# Altium project LPF-SWR.PrjPcb
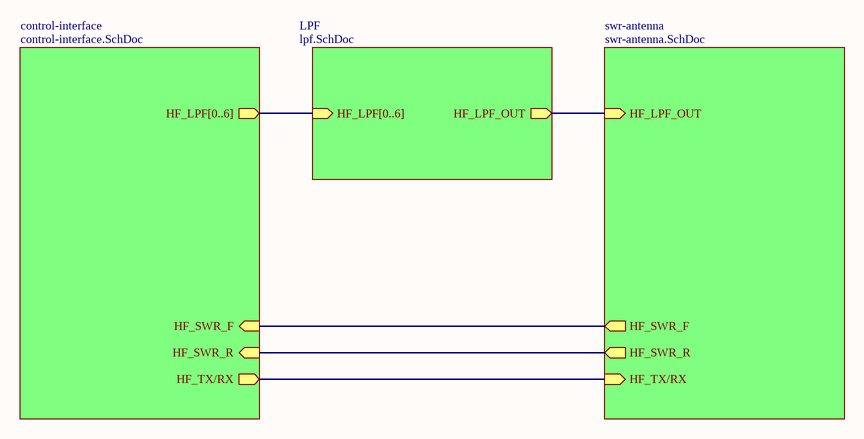
[diagram p0: lpf-swr-srtucture.SchDoc]
4 sheets, 107 parts. Net scope: hierarchical (ports join the sheet entries above them; power ports are global).
Board file: LPF-SWR.PcbDoc
Sheets:
  lpf-swr-srtucture.SchDoc
    control-interface = control-interface.SchDoc
    LPF = lpf.SchDoc
    swr-antenna = swr-antenna.SchDoc

## Sheet lpf-swr-srtucture.SchDoc
size A4; SheetNumber: 1; SheetTotal: 4

### Sub-sheets
control-interface = control-interface.SchDoc: HF_LPF[0..6] (out), HF_SWR_F (in), HF_SWR_R (in), HF_TX/RX (out)
LPF = lpf.SchDoc: HF_LPF_OUT (out), HF_LPF[0..6] (in)
swr-antenna = swr-antenna.SchDoc: HF_LPF_OUT (in), HF_SWR_F (out), HF_SWR_R (out), HF_TX/RX (in)

### Nets
HF_LPF_OUT: sheet LPF/HF_LPF_OUT, sheet swr-antenna/HF_LPF_OUT
HF_TX/RX: sheet control-interface/HF_TX/RX, sheet swr-antenna/HF_TX/RX
NetCON1_12: sheet control-interface/HF_SWR_R, sheet swr-antenna/HF_SWR_R
NetCON1_14: sheet control-interface/HF_SWR_F, sheet swr-antenna/HF_SWR_F

### Buses and harness runs
bus sheet control-interface/HF_LPF[0..6] = sheet LPF/HF_LPF[0..6]

## Sheet control-interface.SchDoc
size A4; SheetNumber: 2; SheetTotal: 4
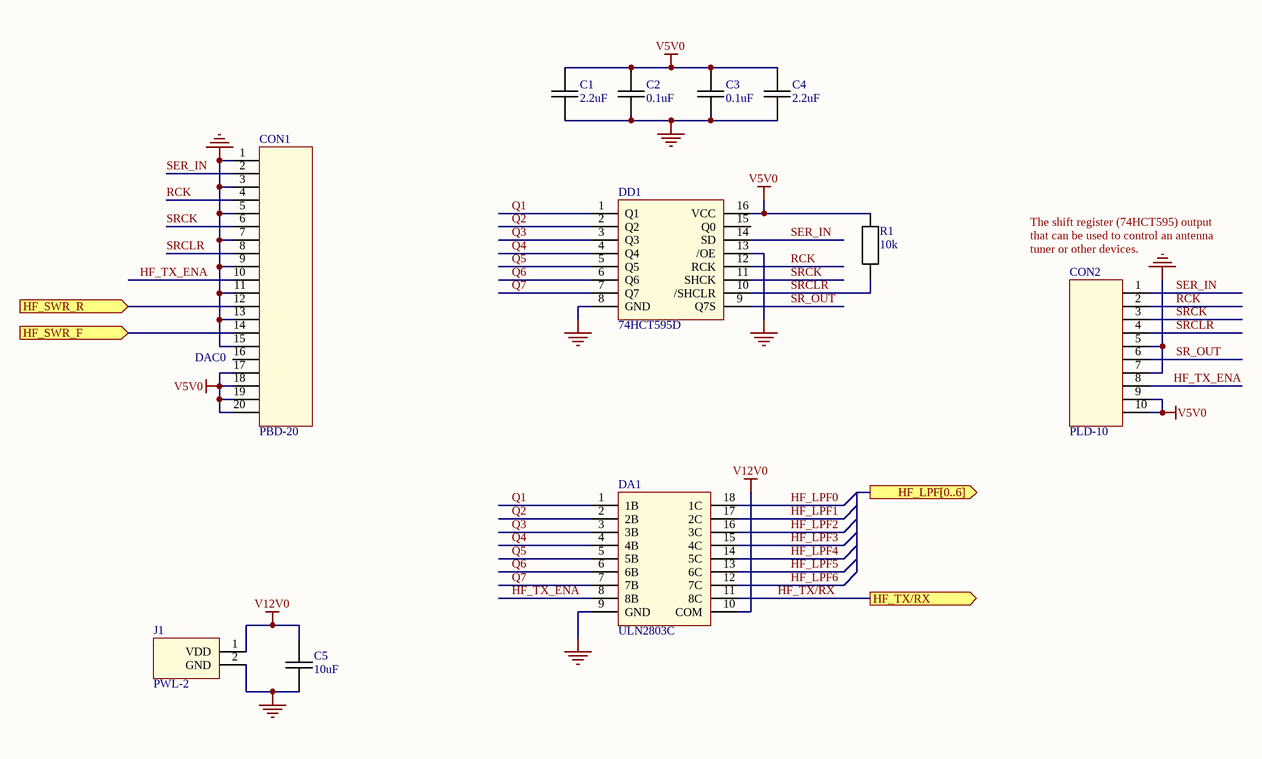
[diagram p1: control-interface.SchDoc]

### Parts
C1  2.2uF  [CAPC2013X100N]
C2  0.1uF  [CAPC2013X100N]
C3  0.1uF  [CAPC2013X100N]
C4  2.2uF  [CAPC2013X100N]
C5  10uF  [CAPC2013X100N]
CON1  PBD-20  [PBD-20]
CON2  PLD-10  [PLD-10R]
DA1  ULN2803C  [SOIC127P1030X265-18N]
DD1  74HCT595D  [SOIC127P600X175-16N]
J1  PWL-2  [PWL-2R]
R1  10k  [RESC2013X64N]

### Ports
HF_LPF[0..6] (out), HF_SWR_F (in), HF_SWR_R (in), HF_TX/RX (out)

### Nets
GND: C1.1 C2.1 C3.1 C4.1 C5.2 CON1.1 CON1.3 CON1.5 CON1.7 CON1.9 CON1.11 CON1.13 CON1.15 CON2.5 CON2.7 DA1.9(GND) DD1.8(GND) DD1.13(/OE) J1.2(GND)
V5V0: C1.2 C2.2 C3.2 C4.2 CON1.17 CON1.18 CON1.19 CON1.20 CON2.9 CON2.10 DD1.16(VCC) R1.2
V12V0: C5.1 DA1.10(COM) J1.1(VDD)
HF_LPF0: DA1.18(1C)
HF_LPF1: DA1.17(2C)
HF_LPF2: DA1.16(3C)
HF_LPF3: DA1.15(4C)
HF_LPF4: DA1.14(5C)
HF_LPF5: DA1.13(6C)
HF_LPF6: DA1.12(7C)
HF_TX/RX: DA1.11(8C) ; port HF_TX/RX
HF_TX_ENA: CON1.10 CON2.8 DA1.8(8B)
Q1: DA1.1(1B) DD1.1(Q1)
Q2: DA1.2(2B) DD1.2(Q2)
Q3: DA1.3(3B) DD1.3(Q3)
Q4: DA1.4(4B) DD1.4(Q4)
Q5: DA1.5(5B) DD1.5(Q5)
Q6: DA1.6(6B) DD1.6(Q6)
Q7: DA1.7(7B) DD1.7(Q7)
RCK: CON1.4 CON2.2 DD1.12(RCK)
SER_IN: CON1.2 CON2.1 DD1.14(SD)
SR_OUT: CON2.6 DD1.9(Q7S)
SRCK: CON1.6 CON2.3 DD1.11(SHCK)
SRCLR: CON1.8 CON2.4 DD1.10(/SHCLR) R1.1
NetCON1_12: CON1.12 ; port HF_SWR_R
NetCON1_14: CON1.14 ; port HF_SWR_F

Not connected (* = marked no-connect by the designer): CON1 16; DD1 15(Q0)

### Notes on the sheet
- (near CON2) The shift register (74HCT595) output that can be used to control an antenna tuner or other devices.
- (near CON1) DAC0

### Library data of the parts
C1-C5 = Cap0805: Capacitor 2x1.25 mm
CON1 = CONNECTOR-20
CON2 = CONNECTOR-10
DA1 = ULN2803A: Darlington Transistor Array
DD1 = 74HCT595D: 8-bit serial-in, serial or parallel-out shift register with output / latches; 3-state
J1 = PWR_CONNECTOR
R1 = Res0805

## Sheet lpf.SchDoc
size A4; SheetNumber: 3; SheetTotal: 4
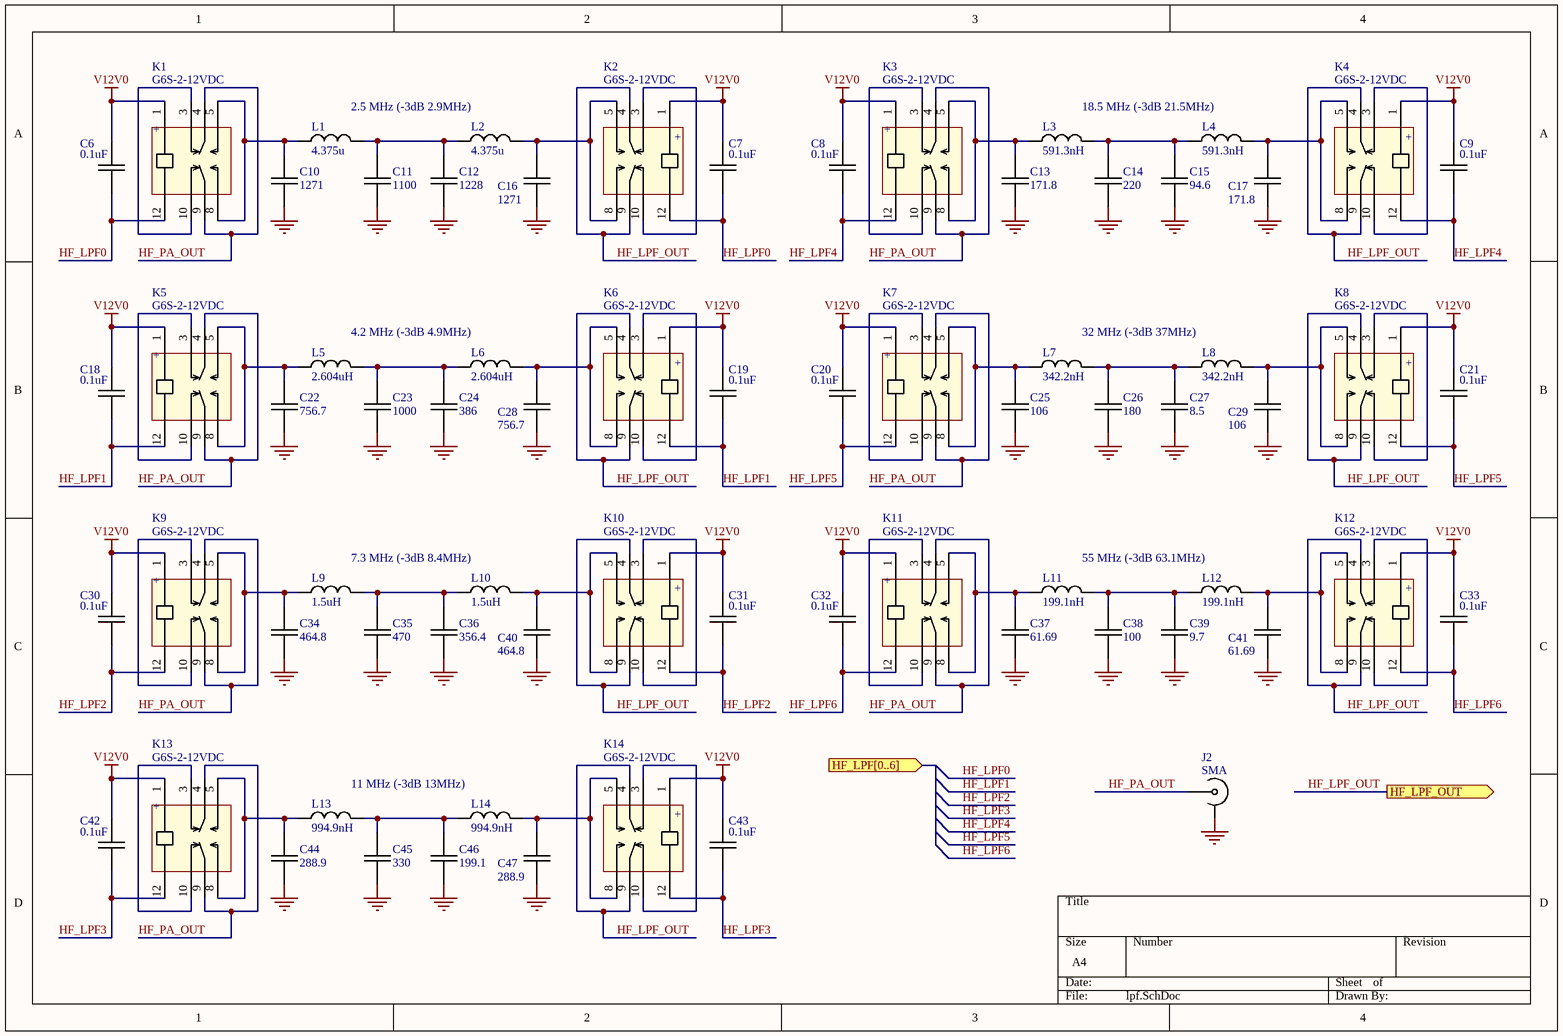
[diagram p2: lpf.SchDoc]

### Parts
C6  0.1uF  [CAPC2013X100N]
C7  0.1uF  [CAPC2013X100N]
C8  0.1uF  [CAPC2013X100N]
C9  0.1uF  [CAPC2013X100N]
C10  1271  [CAPC3216X125N]
C11  1100  [CAPC3216X125N]
C12  1228  [CAPC3216X125N]
C13  171.8  [CAPC3216X125N]
C14  220  [CAPC3216X125N]
C15  94.6  [CAPC3216X125N]
C16  1271  [CAPC3216X125N]
C17  171.8  [CAPC3216X125N]
C18  0.1uF  [CAPC2013X100N]
C19  0.1uF  [CAPC2013X100N]
C20  0.1uF  [CAPC2013X100N]
C21  0.1uF  [CAPC2013X100N]
C22  756.7  [CAPC3216X125N]
C23  1000  [CAPC3216X125N]
C24  386  [CAPC3216X125N]
C25  106  [CAPC3216X125N]
C26  180  [CAPC3216X125N]
C27  8.5  [CAPC3216X125N]
C28  756.7  [CAPC3216X125N]
C29  106  [CAPC3216X125N]
C30  0.1uF  [CAPC2013X100N]
C31  0.1uF  [CAPC2013X100N]
C32  0.1uF  [CAPC2013X100N]
C33  0.1uF  [CAPC2013X100N]
C34  464.8  [CAPC3216X125N]
C35  470  [CAPC3216X125N]
C36  356.4  [CAPC3216X125N]
C37  61.69  [CAPC3216X125N]
C38  100  [CAPC3216X125N]
C39  9.7  [CAPC3216X125N]
C40  464.8  [CAPC3216X125N]
C41  61.69  [CAPC3216X125N]
C42  0.1uF  [CAPC2013X100N]
C43  0.1uF  [CAPC2013X100N]
C44  288.9  [CAPC3216X125N]
C45  330  [CAPC3216X125N]
C46  199.1  [CAPC3216X125N]
C47  288.9  [CAPC3216X125N]
J2  SMA  [SMA002]
K1  G6S-2-12VDC  [G6S-2]
K2  G6S-2-12VDC  [G6S-2]
K3  G6S-2-12VDC  [G6S-2]
K4  G6S-2-12VDC  [G6S-2]
K5  G6S-2-12VDC  [G6S-2]
K6  G6S-2-12VDC  [G6S-2]
K7  G6S-2-12VDC  [G6S-2]
K8  G6S-2-12VDC  [G6S-2]
K9  G6S-2-12VDC  [G6S-2]
K10  G6S-2-12VDC  [G6S-2]
K11  G6S-2-12VDC  [G6S-2]
K12  G6S-2-12VDC  [G6S-2]
K13  G6S-2-12VDC  [G6S-2]
K14  G6S-2-12VDC  [G6S-2]
L1  4.375u  [T50-2]
L2  4.375u  [T50-2]
L3  591.3nH  [T50-6]
L4  591.3nH  [T50-6]
L5  2.604uH  [T50-2]
L6  2.604uH  [T50-2]
L7  342.2nH  [T50-6]
L8  342.2nH  [T50-6]
L9  1.5uH  [T50-6]
L10  1.5uH  [T50-6]
L11  199.1nH  [T50-6]
L12  199.1nH  [T50-6]
L13  994.9nH  [T50-6]
L14  994.9nH  [T50-6]

### Ports
HF_LPF[0..6] (in), HF_LPF_OUT (out)

### Nets
GND: C10.1 C11.1 C12.1 C13.1 C14.1 C15.1 C16.1 C17.1 C22.1 C23.1 C24.1 C25.1 C26.1 C27.1 C28.1 C29.1 C34.1 C35.1 C36.1 C37.1 C38.1 C39.1 C40.1 C41.1 C44.1 C45.1 C46.1 C47.1 J2.2(GND)
V12V0: C6.2 C7.2 C8.2 C9.2 C18.2 C19.2 C20.2 C21.2 C30.2 C31.2 C32.2 C33.2 C42.2 C43.2 K1.1 K2.1 K3.1 K4.1 K5.1 K6.1 K7.1 K8.1 K9.1 K10.1 K11.1 K12.1 K13.1 K14.1
HF_LPF0: C6.1 C7.1 K1.12 K2.12
HF_LPF1: C18.1 C19.1 K5.12 K6.12
HF_LPF2: C30.1 C31.1 K9.12 K10.12
HF_LPF3: C42.1 C43.1 K13.12 K14.12
HF_LPF4: C8.1 C9.1 K3.12 K4.12
HF_LPF5: C20.1 C21.1 K7.12 K8.12
HF_LPF6: C32.1 C33.1 K11.12 K12.12
HF_LPF_OUT: K2.4 K2.9 K4.4 K4.9 K6.4 K6.9 K8.4 K8.9 K10.4 K10.9 K12.4 K12.9 K14.4 K14.9 ; port HF_LPF_OUT
HF_PA_OUT: J2.1(RF) K1.4 K1.9 K3.4 K3.9 K5.4 K5.9 K7.4 K7.9 K9.4 K9.9 K11.4 K11.9 K13.4 K13.9
NetC10_2: C10.2 K1.5 K1.8 L1.1
NetC11_2: C11.2 C12.2 L1.2 L2.1
NetC13_2: C13.2 K3.5 K3.8 L3.1
NetC14_2: C14.2 C15.2 L3.2 L4.1
NetC16_2: C16.2 K2.5 K2.8 L2.2
NetC17_2: C17.2 K4.5 K4.8 L4.2
NetC22_2: C22.2 K5.5 K5.8 L5.1
NetC23_2: C23.2 C24.2 L5.2 L6.1
NetC25_2: C25.2 K7.5 K7.8 L7.1
NetC26_2: C26.2 C27.2 L7.2 L8.1
NetC28_2: C28.2 K6.5 K6.8 L6.2
NetC29_2: C29.2 K8.5 K8.8 L8.2
NetC34_2: C34.2 K9.5 K9.8 L9.1
NetC35_2: C35.2 C36.2 L9.2 L10.1
NetC37_2: C37.2 K11.5 K11.8 L11.1
NetC38_2: C38.2 C39.2 L11.2 L12.1
NetC40_2: C40.2 K10.5 K10.8 L10.2
NetC41_2: C41.2 K12.5 K12.8 L12.2
NetC44_2: C44.2 K13.5 K13.8 L13.1
NetC45_2: C45.2 C46.2 L13.2 L14.1
NetC47_2: C47.2 K14.5 K14.8 L14.2
NetK1_3: K1.3 K1.10
NetK2_3: K2.3 K2.10
NetK3_3: K3.3 K3.10
NetK4_3: K4.3 K4.10
NetK5_3: K5.3 K5.10
NetK6_3: K6.3 K6.10
NetK7_3: K7.3 K7.10
NetK8_3: K8.3 K8.10
NetK9_3: K9.3 K9.10
NetK10_3: K10.3 K10.10
NetK11_3: K11.3 K11.10
NetK12_3: K12.3 K12.10
NetK13_3: K13.3 K13.10
NetK14_3: K14.3 K14.10

### Notes on the sheet
- 2.5 MHz (-3dB 2.9MHz)
- 18.5 MHz (-3dB 21.5MHz)
- 4.2 MHz (-3dB 4.9MHz)
- 32 MHz (-3dB 37MHz)
- 7.3 MHz (-3dB 8.4MHz)
- 55 MHz (-3dB 63.1MHz)
- 11 MHz (-3dB 13MHz)
- (in symbol G6S-2-12VDC) +

### Library data of the parts
C6-C9 C18-C21 C30-C33 C42 C43 = Cap0805: Capacitor 2x1.25 mm
C10-C17 C22-C29 C34-C41 C44-C47 = Cap1206: Capacitor 3.2x1.6 mm
J2 = RF Connector
K1-K14 = G6S-2-12VDC: Compact, Industry-Standard 2-pole relay
L1 L2 L5 L6 = Inductor: T50-2
L3 L4 L7-L14 = Inductor: T50-6

## Sheet swr-antenna.SchDoc
size A4; SheetNumber: 4; SheetTotal: 4
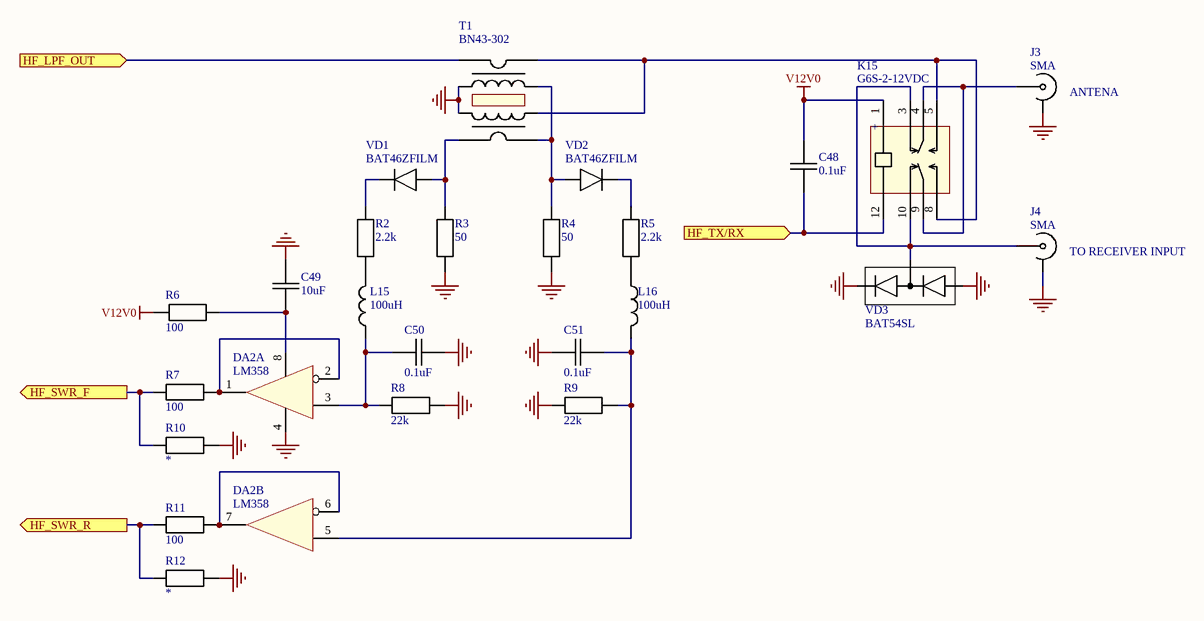
[diagram p3: swr-antenna.SchDoc]

### Parts
C48  0.1uF  [CAPC2013X100N]
C49  10uF  [CAPC2013X100N]
C50  0.1uF  [CAPC2013X100N]
C51  0.1uF  [CAPC2013X100N]
DA2  LM358  [SOIC127P600X175-8N]  (parts A,B of 2)
J3  SMA  [SMA002]
J4  SMA  [SMA002]
K15  G6S-2-12VDC  [G6S-2]
L15  100uH  [INDUCTOR-1008]
L16  100uH  [INDUCTOR-1008]
R2  2.2k  [RESC2013X64N]
R3  50  [RESC2013X64N]
R4  50  [RESC2013X64N]
R5  2.2k  [RESC2013X64N]
R6  100  [RESC2013X64N]
R7  100  [RESC2013X64N]
R8  22k  [RESC2013X64N]
R9  22k  [RESC2013X64N]
R10  *  [RESC2013X64N]
R11  100  [RESC2013X64N]
R12  *  [RESC2013X64N]
T1  BN43-302  [TANDEM]
VD1  BAT46ZFILM  [SOD3816X118N]
VD2  BAT46ZFILM  [SOD3816X118N]
VD3  BAT54SL  [SOT95P229X119-3N]

### Ports
HF_LPF_OUT (in), HF_SWR_F (out), HF_SWR_R (out), HF_TX/RX (in)

### Nets
GND: C49.1 C50.2 C51.1 DA2.4(GND) J3.2(GND) J4.2(GND) R3.1 R4.1 R8.1 R9.2 R10.1 R12.1 T1.3 T1.5 VD3.1(A) VD3.2(C)
V12V0: C48.2 K15.1 R6.1
HF_LPF_OUT: T1.1 ; port HF_LPF_OUT
HF_TX/RX: C48.1 K15.12 ; port HF_TX/RX
NetC49_2: C49.2 DA2.8(VCC) R6.2
NetC50_1: C50.1 DA2.3(IN1+) L15.1 R8.2
NetC51_2: C51.2 DA2.5(IN2+) L16.2 R9.1
NetCON1_12: R11.2 R12.2 ; port HF_SWR_R
NetCON1_14: R7.2 R10.2 ; port HF_SWR_F
NetDA2_1: DA2.1(OUT1) DA2.2(IN1-) R7.1
NetDA2_6: DA2.6(IN2-) DA2.7(OUT2) R11.1
NetJ3_1: J3.1(RF) K15.4 K15.9
NetJ4_1: J4.1(RF) K15.3 K15.10 VD3.3(AC)
NetK15_5: K15.5 K15.8 T1.2 T1.6
NetL15_2: L15.2 R2.1
NetL16_1: L16.1 R5.1
NetR2_2: R2.2 VD1.1(C)
NetR3_2: R3.2 T1.7 VD1.2(A)
NetR4_2: R4.2 T1.4 T1.8 VD2.2(A)
NetR5_2: R5.2 VD2.1(C)

### Notes on the sheet
- (near J3) ANTENA
- (near J4) TO RECEIVER INPUT
- (in symbol G6S-2-12VDC) +

### Library data of the parts
C48-C51 = Cap0805: Capacitor 2x1.25 mm
DA2 = LM358: Single Supply Dual / Operational Amplifiers
J3 = RF Connector: EM-BC028M-NGP-50
J4 = RF Connector
K15 = G6S-2-12VDC: Compact, Industry-Standard 2-pole relay
L15 L16 = Inductor: SWI1008HT101K-Hitano
R2-R12 = Res0805
T1 = tandem match
VD1 VD2 = DIODE: Small signal Schottky diodes; pin to pad: 1>2
VD3 = DIODE-2-1A-3C-3A-2C

## Nets that join several sheets
GND: control-interface (19 pins), lpf (29 pins), swr-antenna (16 pins)
V12V0: control-interface (C5.1 DA1.10 J1.1), lpf (28 pins), swr-antenna (C48.2 K15.1 R6.1)
HF_LPF_OUT: lpf (14 pins), swr-antenna (T1.1)
HF_TX/RX: control-interface (DA1.11), swr-antenna (C48.1 K15.12)
NetCON1_12: control-interface (CON1.12), swr-antenna (R11.2 R12.2)
NetCON1_14: control-interface (CON1.14), swr-antenna (R7.2 R10.2)